# EAGLE design KR55_soundgen (EAGLE 7.1.0)
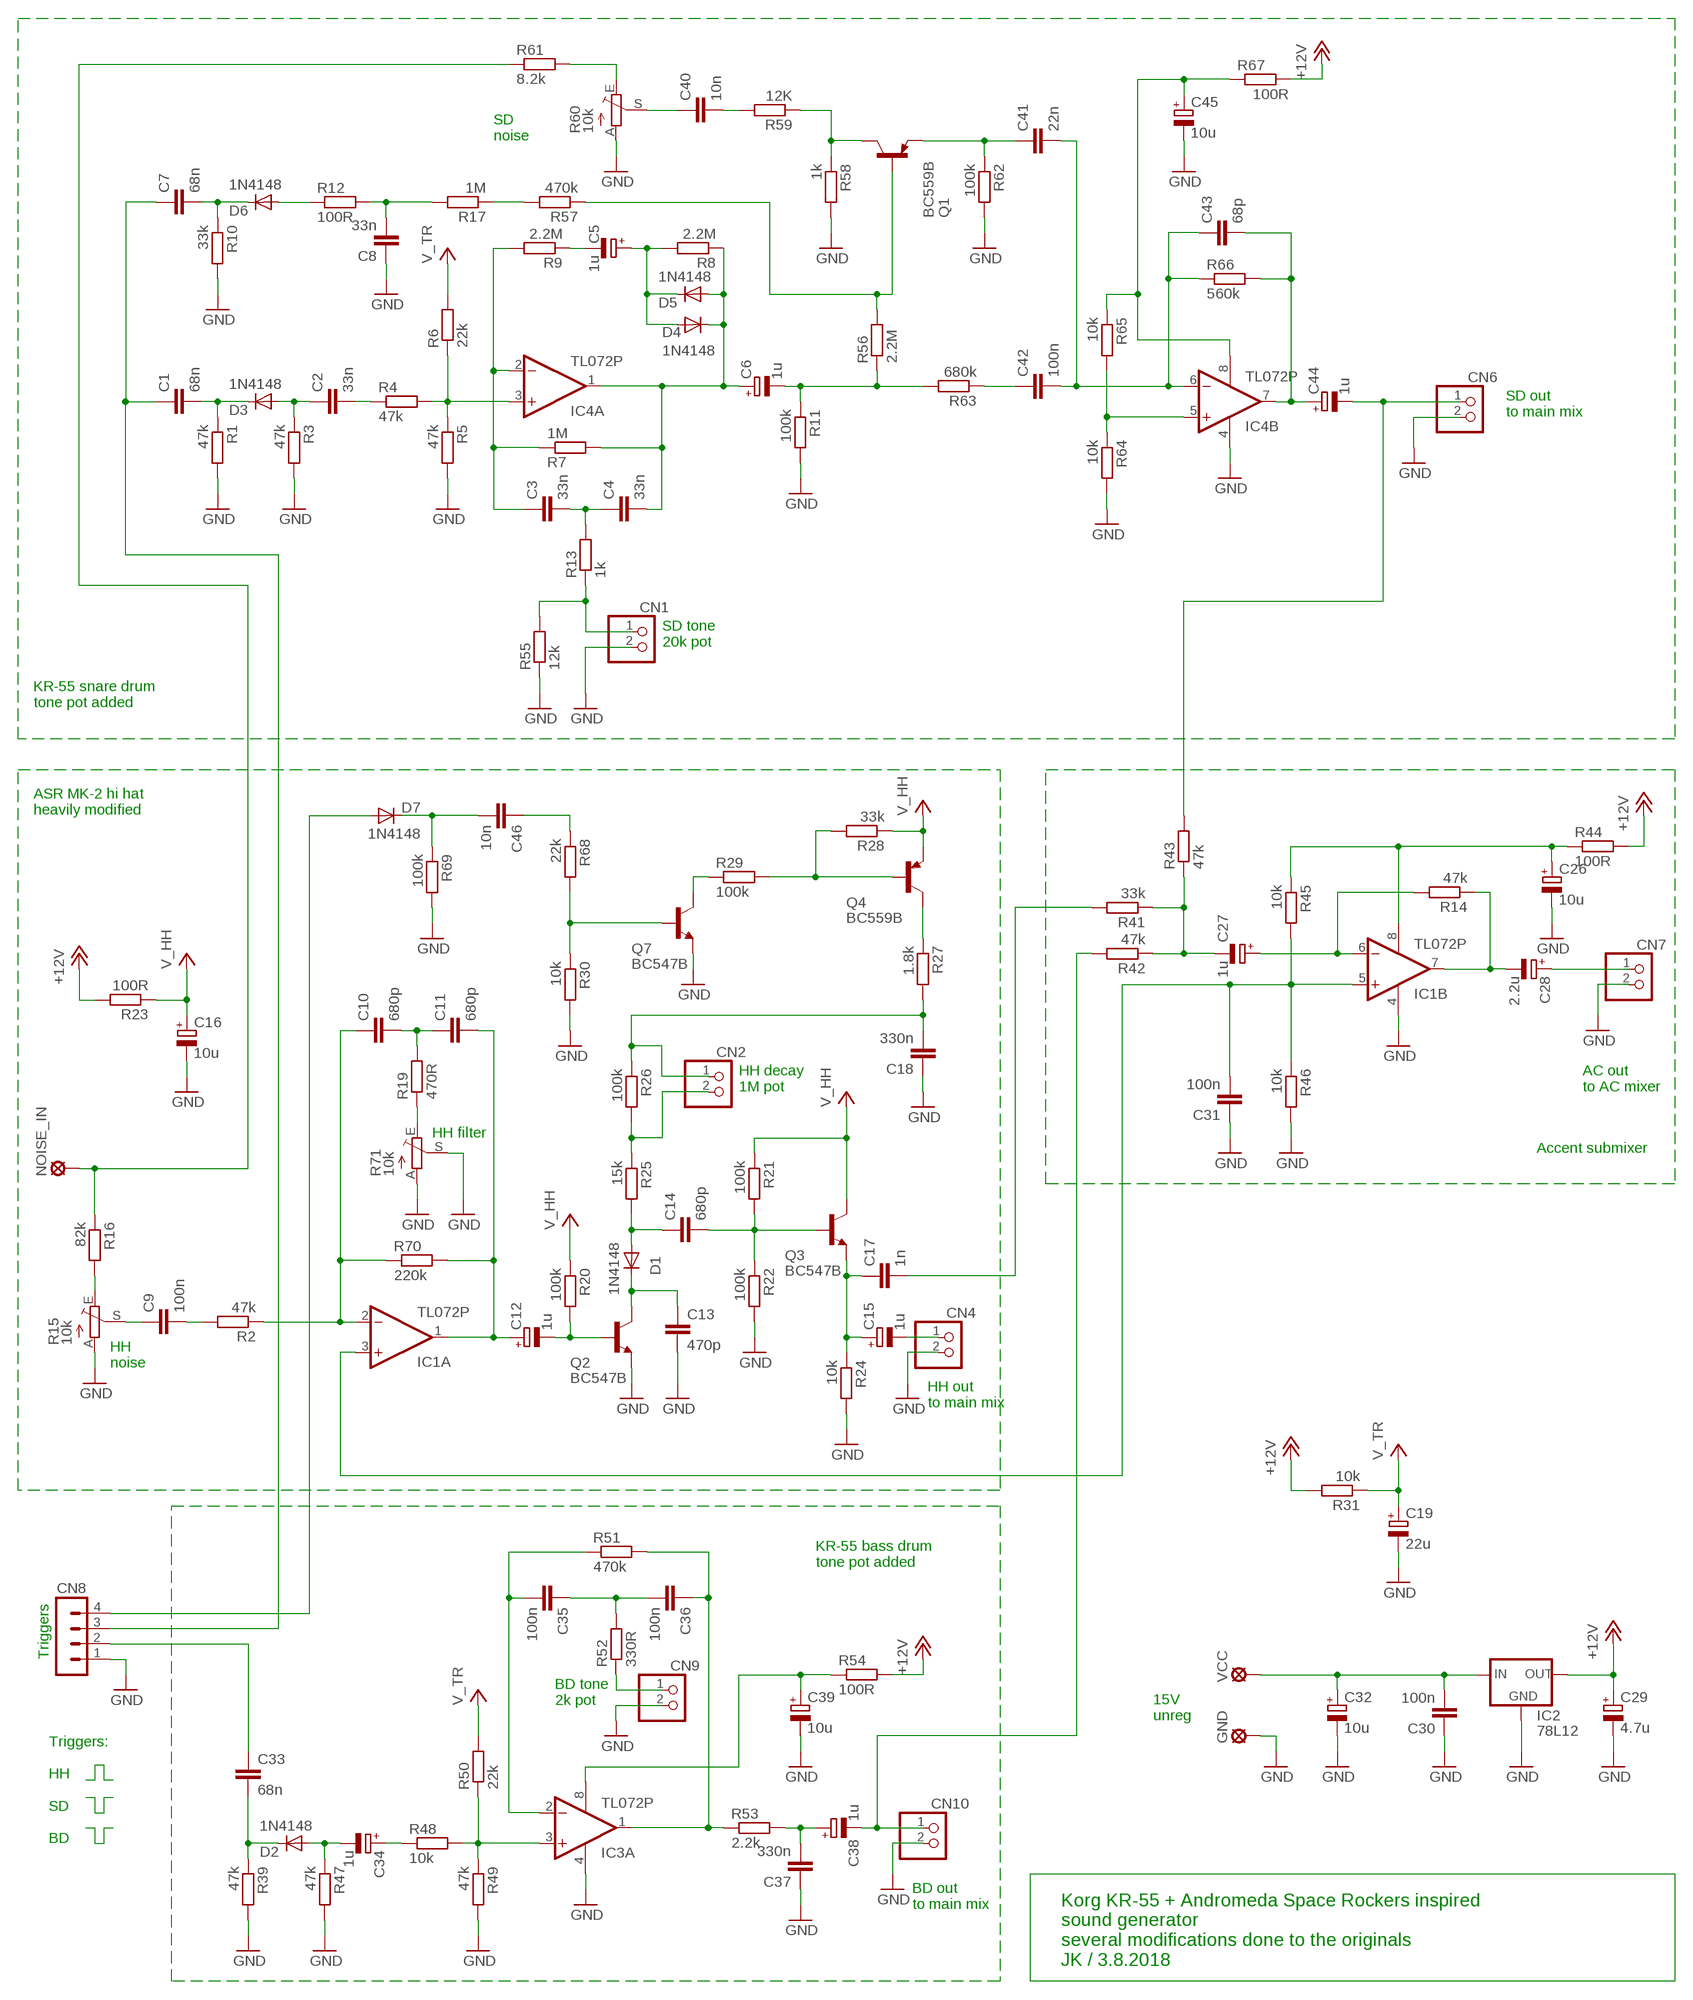
[diagram p0: schematic, sheet 1]

## Parts
C1  68n  C-EUC0805  [C0805]
C2  33n  C-EUC0805  [C0805]
C3  33n  C-EUC0805  [C0805]
C4  33n  C-EUC0805  [C0805]
C5  1u  CPOL-EUSMCA  [SMC_A]
C6  1u  CPOL-EUSMCA  [SMC_A]
C7  68n  C-EUC0805  [C0805]
C8  33n  C-EUC0805  [C0805]
C9  100n  C-EUC0805  [C0805]
C10  680p  C-EUC0805  [C0805]
C11  680p  C-EUC0805  [C0805]
C12  1u  CPOL-EUSMCA  [SMC_A]
C13  470p  C-EUC0805  [C0805]
C14  680p  C-EUC0805  [C0805]
C15  1u  CPOL-EUSMCA  [SMC_A]
C16  10u  CPOL-EUE2.5-5  [E2,5-5]
C17  1n  C-EUC0805  [C0805]
C18  330n  C-EUC0805  [C0805]
C19  22u  CPOL-EUE2.5-5  [E2,5-5]
C26  10u  CPOL-EUE5-5  [E5-5]
C27  1u  CPOL-EUSMCA  [SMC_A]
C28  2.2u  CPOL-EUSMCA  [SMC_A]
C29  4.7u  CPOL-EUSMCA  [SMC_A]
C30  100n  C-EUC0805  [C0805]
C31  100n  C-EUC0805  [C0805]
C32  10u  CPOL-EUE2.5-5  [E2,5-5]
C33  68n  C-EUC0805  [C0805]
C34  1u  CPOL-EUSMCA  [SMC_A]
C35  100n  C-EUC0805  [C0805]
C36  100n  C-EUC0805  [C0805]
C37  330n  C-EUC0805  [C0805]
C38  1u  CPOL-EUSMCA  [SMC_A]
C39  10u  CPOL-EUE2.5-5  [E2,5-5]
C40  10n  C-EUC1206  [C1206]
C41  22n  C-EUC0805  [C0805]
C42  100n  C-EU050-024X044  [C050-024X044]
C43  68p  C-EUC0805  [C0805]
C44  1u  CPOL-EUSMCA  [SMC_A]
C45  10u  CPOL-EUE2.5-5  [E2,5-5]
C46  10n  C-EUC0805  [C0805]
CN1  PINHD-1X2  [1X02]
CN2  PINHD-1X2  [1X02]
CN4  PINHD-1X2  [1X02]
CN6  PINHD-1X2  [1X02]
CN7  PINHD-1X2  [1X02]
CN8  MA04-1  [MA04-1]
CN9  PINHD-1X2  [1X02]
CN10  PINHD-1X2  [1X02]
D1  1N4148  DIODE-SOD80C  [SOD80C]
D2  1N4148  DIODE-SOD80C  [SOD80C]
D3  1N4148  DIODE-SOD80C  [SOD80C]
D4  1N4148  DIODE-SOD80C  [SOD80C]
D5  1N4148  DIODE-SOD80C  [SOD80C]
D6  1N4148  DIODE-SOD80C  [SOD80C]
D7  1N4148  DIODE-DO35-10  [DO35-10]
GND  LSP10  [LSP10]
IC1  TL072P  [DIL08]
IC2  78L12  78LXX  [78LXX]
IC3  TL072P  [DIL08]
IC4  TL072P  [DIL08]
NOISE_IN  LSP10  [LSP10]
Q1  BC559B  [TO92-EBC]
Q2  BC547B  [TO92]
Q3  BC547B  [TO92]
Q4  BC559B  [TO92-EBC]
Q7  BC547B  [TO92]
R1  47k  R-EU_R0805  [R0805]
R2  47k  R-EU_R0805  [R0805]
R3  47k  R-EU_R0805  [R0805]
R4  47k  R-EU_R0805  [R0805]
R5  47k  R-EU_R0805  [R0805]
R6  22k  R-EU_R0805  [R0805]
R7  1M  R-EU_R0805  [R0805]
R8  2.2M  R-EU_R0805  [R0805]
R9  2.2M  R-EU_R0805  [R0805]
R10  33k  R-EU_R0805  [R0805]
R11  100k  R-EU_R0805  [R0805]
R12  100R  R-EU_R0805  [R0805]
R13  1k  R-EU_R0805  [R0805]
R14  47k  R-EU_R0805  [R0805]
R15  10k  TRIM_EU-S63X  [S63X]
R16  82k  R-EU_R0805  [R0805]
R17  1M  R-EU_R0805  [R0805]
R19  470R  R-EU_0207/10  [0207/10]
R20  100k  R-EU_0207/10  [0207/10]
R21  100k  R-EU_R0805  [R0805]
R22  100k  R-EU_R0805  [R0805]
R23  100R  R-EU_R0805  [R0805]
R24  10k  R-EU_R0805  [R0805]
R25  15k  R-EU_0207/10  [0207/10]
R26  100k  R-EU_R0805  [R0805]
R27  1.8k  R-EU_0207/10  [0207/10]
R28  33k  R-EU_R0805  [R0805]
R29  100k  R-EU_R0805  [R0805]
R30  10k  R-EU_R0805  [R0805]
R31  10k  R-EU_R0805  [R0805]
R39  47k  R-EU_R0805  [R0805]
R41  33k  R-EU_R0805  [R0805]
R42  47k  R-EU_R0805  [R0805]
R43  47k  R-EU_R0805  [R0805]
R44  100R  R-EU_0207/10  [0207/10]
R45  10k  R-EU_R0805  [R0805]
R46  10k  R-EU_R0805  [R0805]
R47  47k  R-EU_R0805  [R0805]
R48  10k  R-EU_R0805  [R0805]
R49  47k  R-EU_R0805  [R0805]
R50  22k  R-EU_R0805  [R0805]
R51  470k  R-EU_R0805  [R0805]
R52  330R  R-EU_R0805  [R0805]
R53  2.2k  R-EU_0207/10  [0207/10]
R54  100R  R-EU_0207/10  [0207/10]
R55  12k  R-EU_R0805  [R0805]
R56  2.2M  R-EU_R0805  [R0805]
R57  470k  R-EU_R0805  [R0805]
R58  1k  R-EU_R0805  [R0805]
R59  12K  R-EU_R0805  [R0805]
R60  10k  TRIM_EU-S63X  [S63X]
R61  8.2k  R-EU_R0805  [R0805]
R62  100k  R-EU_R0805  [R0805]
R63  680k  R-EU_R0805  [R0805]
R64  10k  R-EU_R0805  [R0805]
R65  10k  R-EU_R0805  [R0805]
R66  560k  R-EU_R0805  [R0805]
R67  100R  R-EU_R0805  [R0805]
R68  22k  R-EU_R0805  [R0805]
R69  100k  R-EU_R0805  [R0805]
R70  220k  R-EU_R0805  [R0805]
R71  10k  TRIM_EU-S63X  [S63X]
VCC  LSP10  [LSP10]

## Nets
+12V: C29.+ IC2.OUT R23.2 R31.2 R44.2 R54.2 R67.2
+15V: C30.2 C32.+ IC2.IN VCC.MP
GND: C8.1 C13.2 C16.- C18.1 C19.- C26.- C29.- C30.1 C31.1 C32.- C37.1 C39.- C45.- CN1.2 CN4.2 CN6.2 CN7.2 CN8.1 CN9.2 CN10.2 GND.MP IC1.4(P:V-) IC2.GND IC3.4(P:V-) IC4.4(P:V-) Q2.1(E) Q7.1(E) R1.2 R3.2 R5.2 R10.2 R11.2 R15.A R22.2 R24.2 R30.2 R39.2 R46.2 R47.2 R49.2 R55.1 R58.2 R60.A R62.2 R64.2 R69.2 R71.A R71.S
N$2: C3.1 IC4.2(A:-IN) R7.1 R9.2
N$3: C4.2 C6.+ D4.C D5.A IC4.1(A:OUT) R7.2 R8.1
N$4: IC4.3(A:+IN) R4.2 R5.1 R6.1
N$5: C2.2 R4.1
N$6: C2.1 D3.A R3.1
N$7: C1.2 D3.C R1.1
N$8: R15.E R16.2
N$9: CN1.1 R13.1 R55.2
N$10: C9.1 R15.S
N$11: C5.- R9.1
N$12: C5.+ D4.A D5.C R8.2
N$13: R60.E R61.2
N$14: C9.2 R2.2
N$15: R19.1 R71.E
N$17: C12.- Q2.2(B) R20.2
N$18: C11.2 C12.+ IC1.1(A:OUT) R70.2
N$19: C13.1 D1.C Q2.3(C)
N$20: C10.1 IC1.2(A:-IN) R2.1 R70.1
N$21: C10.2 C11.1 R19.2
N$23: C14.1 D1.A R25.2
N$24: C14.2 Q3.2(B) R21.2 R22.1
N$25: C41.2 C42.2 C43.1 IC4.6(B:-IN) R66.1
N$26: C35.2 IC3.2(A:-IN) R51.1
N$27: C15.+ C17.1 Q3.1(E) R24.1
N$28: CN2.2 R25.1 R26.2
N$29: C18.2 CN2.1 R26.1 R27.2
N$30: C8.2 R12.2 R17.2
N$31: Q4.C R27.1
N$32: R17.1 R57.2
N$41: C27.- R41.1 R42.1 R43.1
N$42: C28.- IC1.7(B:OUT) R14.1
N$43: C27.+ IC1.6(B:-IN) R14.2
N$50: C36.1 IC3.1(A:OUT) R51.2 R53.1
N$51: C35.1 C36.2 R52.2
N$52: CN9.1 R52.1
N$53: IC3.3(A:+IN) R48.2 R49.1 R50.1
N$54: C34.+ R48.1
N$55: C34.- D2.A R47.1
N$56: C33.2 D2.C R39.1
N$57: C37.2 C38.+ R53.2
N$59: C3.2 C4.1 R13.2
N$61: C40.1 R60.S
N$62: D6.A R12.1
N$63: C7.2 D6.C R10.1
N$64: C40.2 R59.2
N$65: Q1.C R58.1 R59.1
N$66: Q1.B R56.2 R57.1
N$67: C6.- R11.1 R56.1 R63.2
N$68: C42.1 R63.1
N$69: C41.1 Q1.E R62.1
N$71: IC4.5(B:+IN) R64.1 R65.2
N$72: C43.2 C44.+ IC4.7(B:OUT) R66.2
N$74: C45.+ IC4.8(P:V+) R65.1 R67.1
N$78: Q4.B R28.2 R29.2
N$79: Q7.3(C) R29.1
N$80: Q7.2(B) R30.1 R68.2
N$81: C46.1 R68.1
N$82: C46.2 D7.C R69.1
NOISE_IN: NOISE_IN.MP R16.1 R61.1
OUT_AC: C28.+ CN7.1
OUT_BD: C38.- CN10.1 R42.2
OUT_HH: C15.- CN4.1
OUT_HH_AC: C17.2 R41.2
OUT_SD: C44.- CN6.1 R43.2
TRIG_BD: C33.1 CN8.2
TRIG_HH: CN8.4 D7.A
TRIG_SD: C1.1 C7.1 CN8.3
V_BD: C39.+ IC3.8(P:V+) R54.1
V_HH: C16.+ Q3.3(C) Q4.E R20.1 R21.1 R23.1 R28.1
V_MX: C26.+ IC1.8(P:V+) R44.1 R45.1
V_MX/2: C31.2 IC1.3(A:+IN) IC1.5(B:+IN) R45.2 R46.1
V_TR: C19.+ R6.2 R31.1 R50.2
Unconnected: IC3.5(B:+IN) IC3.6(B:-IN) IC3.7(B:OUT)

## Notes on the sheet
- SD
  noise
- SD out
  to main mix
- SD tone
  20k pot
- KR-55 snare drum
  tone pot added
- ASR MK-2 hi hat
  heavily modified
- HH decay
  1M pot
- AC out
  to AC mixer
- HH filter
- Accent submixer
- HH
  noise
- HH out
  to main mix
- KR-55 bass drum
  tone pot added
- Triggers
- BD tone
  2k pot
- 15V
  unreg
- Triggers:
  
  HH
  
  SD
  
  BD
- BD out
  to main mix
- Korg KR-55 + Andromeda Space Rockers inspired
  sound generator
  several modifications done to the originals
  JK / 3.8.2018

## Library data of the parts
C1-C4 C7-C11 C13 C14 C17 C18 C30 C31 C33 C35-C37 C40-C43 C46 = rcl:C-EU: CAPACITOR, European symbol
C5 C6 C12 C15 C16 C19 C26-C29 C32 C34 C38 C39 C44 C45 = rcl:CPOL-EU: POLARIZED CAPACITOR, European symbol
CN1 CN2 CN4 CN6 CN7 CN9 CN10 = pinhead:PINHD-1X2: PIN HEADER
CN8 = con-lstb:MA04-1: PIN HEADER; OC_FARNELL: unknown; OC_NEWARK: unknown
D1-D7 = diode:DIODE-: DIODE
GND NOISE_IN VCC = solpad:LSP10: SOLDER PAD drill 1.0 mm, distributor Buerklin, 12H555
IC1 IC3 IC4 = linear:TL072: OP AMP
IC2 = v-reg:78LXX: VOLTAGE REGULATOR
Q1 Q4 = transistor-pnp:BC559*: PNP Transistror
Q2 Q3 Q7 = transistor-npn:BC547*: NPN Transistor
R1-R14 R16 R17 R19-R31 R39 R41-R59 R61-R70 = rcl:R-EU_: RESISTOR, European symbol
R15 R60 R71 = pot:TRIM_EU-: POTENTIOMETER

## Board
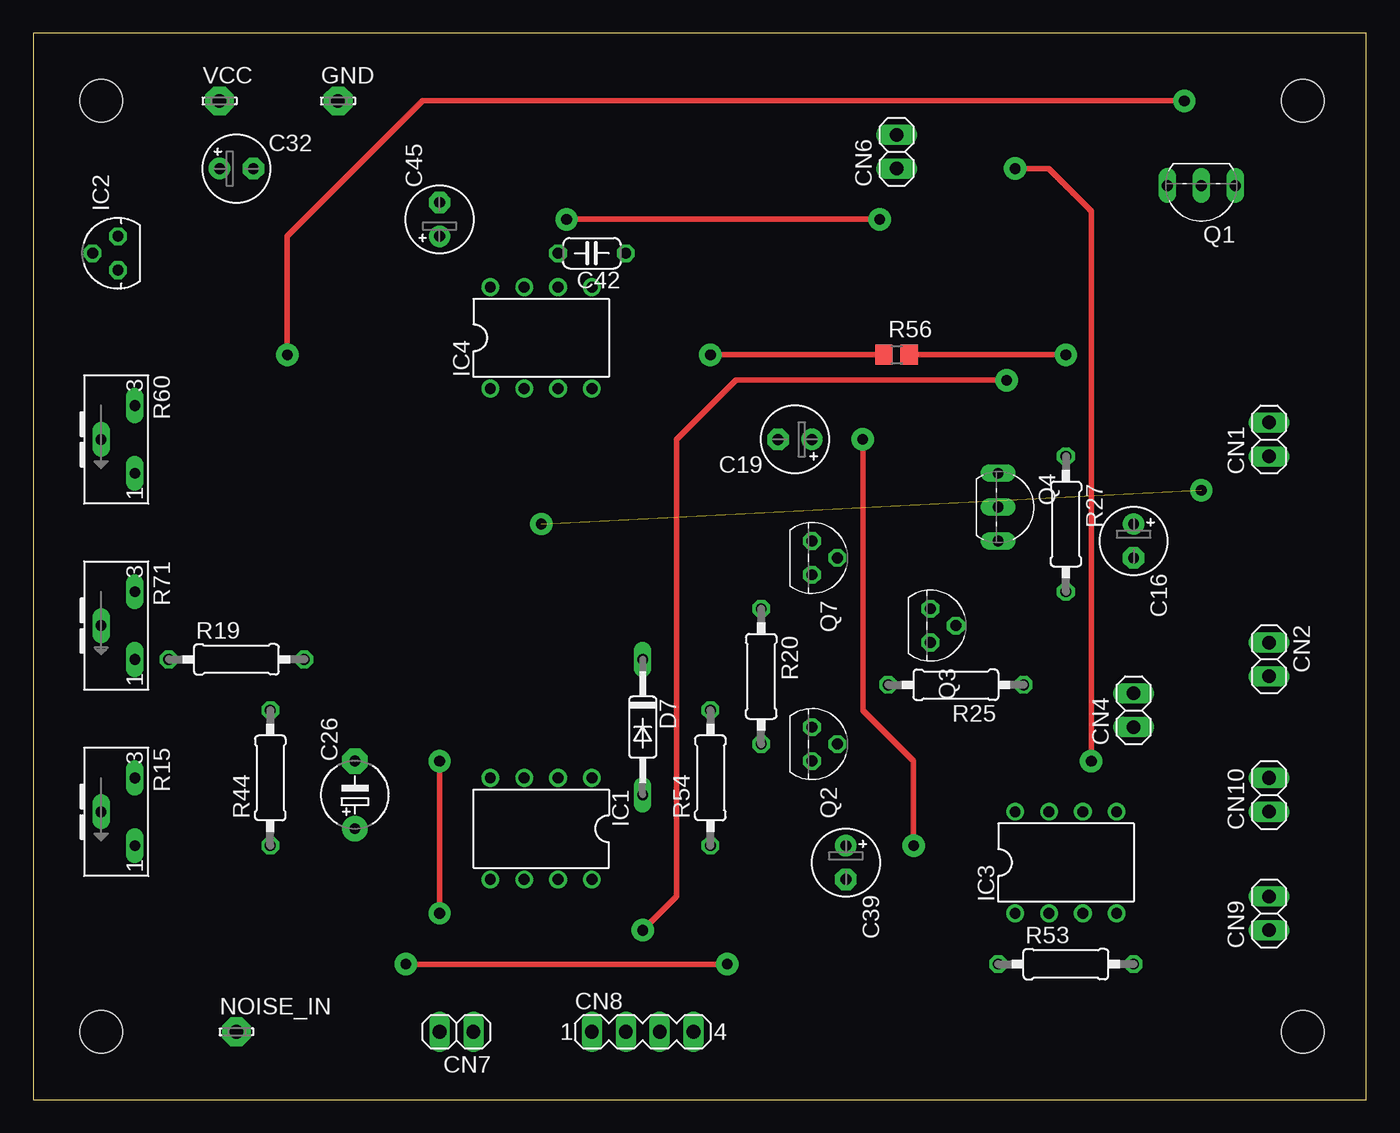
[diagram p1: board, top side]
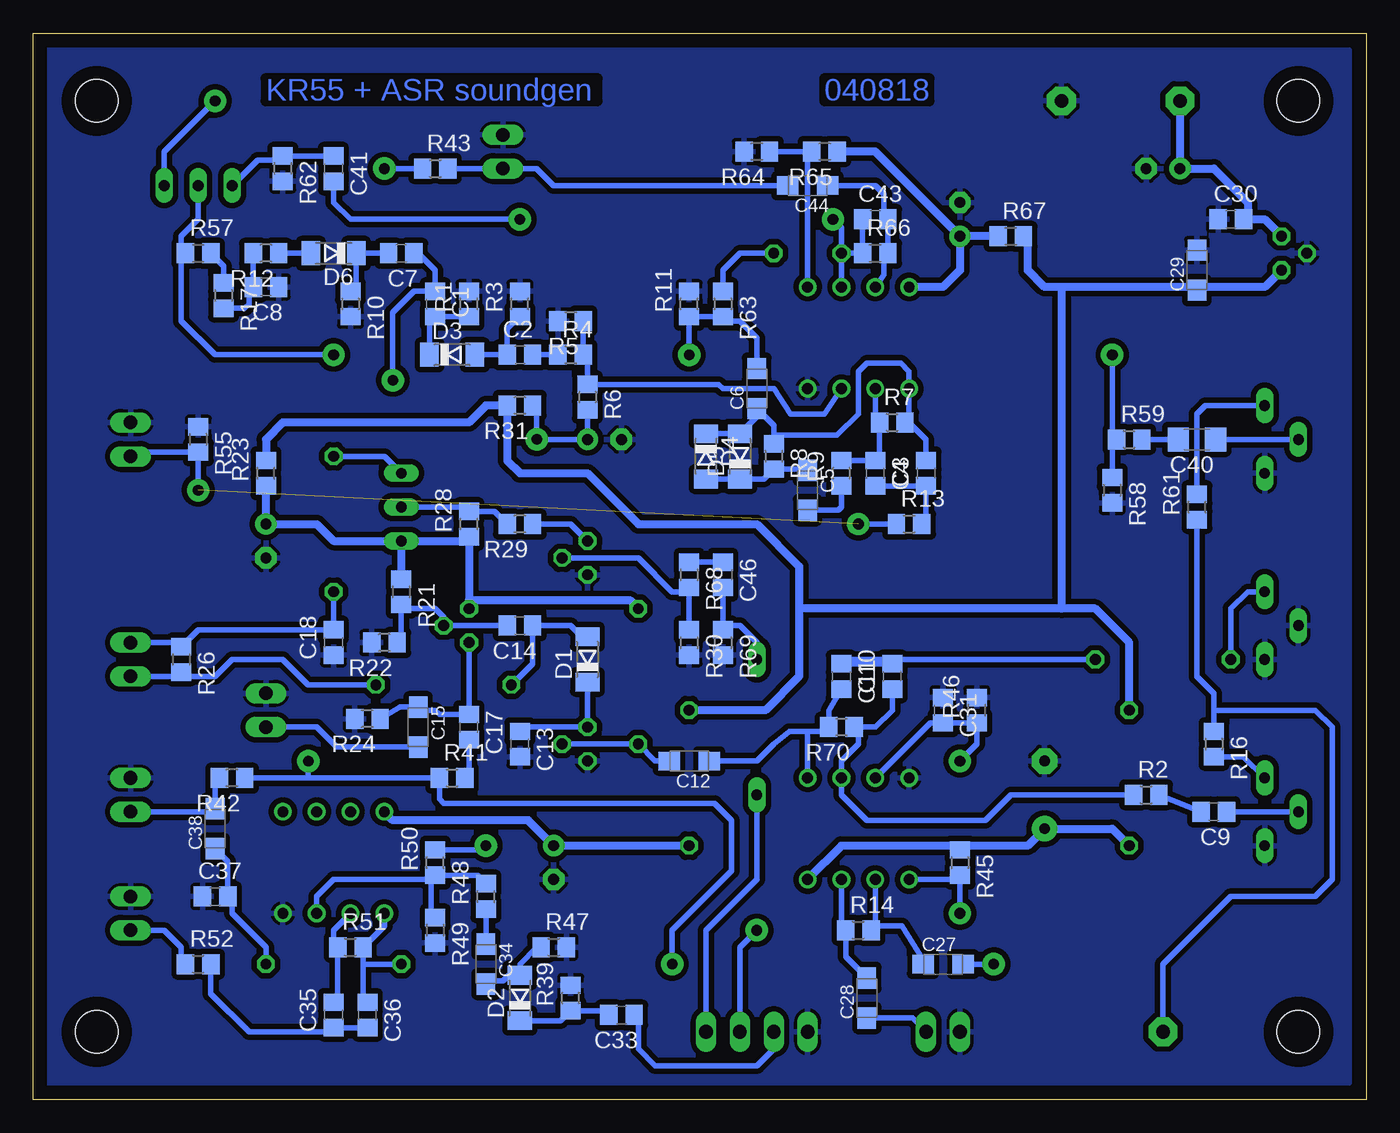
[diagram p2: board, bottom side, seen from below]

Size 100 x 80 mm. Coordinates in mm from the lower left corner, seen from the top.
Outline: 0,0 100,0 100,80 0,80 0,0
Copper layers (1*16): Top 0.035mm / dielectric 1.5mm / Bottom 0.035mm
Design rules "default": minimum track width 10mil, minimum drill 24mil, track to track 8mil, track to pad 8mil, pad to pad 8mil, via to via 8mil, smd to smd 8mil, copper to edge 40mil, drill to drill 8mil, minimum pad ring 10mil, minimum via ring 8mil, stop-mask expansion 4mil, vias tented up to drill 0mil, thermal gap 10mil
Holes 3.2 mm at 5.08,5.08 95.25,5.08 95.25,74.93 5.08,74.93

### Footprints (pad centres in the part's own frame; a part is rotated, then mirrored left to right if it is on the bottom)
C0805 = smd 1.3 x 1.5: 1 -0.95,0; 2 0.95,0
SMC_A = smd 1.6 x 1.4: + -1.5,0; - 1.5,0
E2,5-5 = drill 0.813 pad 1.6: + -1.27,0 | drill 0.813 pad 1.6 octagon: - 1.27,0
E5-5 = drill 0.813 pad 1.905: + -2.54,0 | drill 0.813 pad 1.905 octagon: - 2.54,0
C1206 = smd 1.6 x 1.8: 1 -1.4,0; 2 1.4,0
C050-024X044 = drill 0.813 octagon: 1 -2.54,0; 2 2.54,0
1X02 = drill 1.016 long: 1 -1.27,0; 2 1.27,0
MA04-1 = drill 1.016 long: 1 -3.81,0; 2 -1.27,0; 3 1.27,0; 4 3.81,0
SOD80C = smd 1.4 x 1.8: A 1.7,0; C -1.7,0
DO35-10 = drill 0.813 long: A 5.08,0; C -5.08,0
LSP10 = drill 1.016 pad 2.159 octagon: MP 0,0
DIL08 = drill 0.813 pad 1.27: 1 -3.81,-3.81; 2 -1.27,-3.81; 3 1.27,-3.81; 4 3.81,-3.81; 5 3.81,3.81; 6 1.27,3.81; 7 -1.27,3.81; 8 -3.81,3.81
78LXX = drill 0.813 octagon: GND 0,1.905; IN 1.27,0; OUT -1.27,0
TO92-EBC = drill 0.813 long: B 0,-1.27; C -2.54,-1.27; E 2.54,-1.27
TO92 = drill 0.813 octagon: 1 1.27,0; 2 0,1.905; 3 -1.27,0
R0805 = smd 1.3 x 1.5: 1 -0.95,0; 2 0.95,0
S63X = drill 0.813 long: A 2.54,0; E -2.54,0; S 0,-2.54
0207/10 = drill 0.813 octagon: 1 -5.08,0; 2 5.08,0

### Placement (x,y rotation side)
C1  69.85,59.69 270 bottom
C2  63.5,55.88 0 bottom
C3  36.83,46.99 270 bottom
C4  33.02,46.99 90 bottom
C5  41.91,45.72 270 bottom
C6  45.72,53.34 90 bottom
C7  72.39,63.5 180 bottom
C8  82.55,60.96 180 bottom
C9  11.43,21.59 180 bottom
C10  35.56,31.75 90 bottom
C11  39.37,31.75 270 bottom
C12  50.8,25.4 180 bottom
C13  63.5,26.67 270 bottom
C14  63.5,35.56 180 bottom
C15  71.12,27.94 270 bottom
C16  82.55,41.91 270 top
C17  67.31,27.94 270 bottom
C18  77.47,34.29 90 bottom
C19  57.15,49.53 180 top
C26  24.13,22.86 90 top
C27  31.75,10.16 0 bottom
C28  37.47,7.62 90 bottom
C29  12.7,62.23 90 bottom
C30  10.16,66.04 0 bottom
C31  31.75,29.21 270 bottom
C32  15.24,69.85 0 top
C33  55.88,6.35 180 bottom
C34  66.04,10.16 270 bottom
C35  77.47,6.35 90 bottom
C36  74.93,6.35 270 bottom
C37  86.36,15.24 0 bottom
C38  86.36,20.32 90 bottom
C39  60.96,17.78 270 top
C40  12.7,49.53 180 bottom
C41  77.47,69.85 270 bottom
C42  41.91,63.5 180 top
C43  36.83,66.04 0 bottom
C44  41.91,68.58 180 bottom
C45  30.48,66.04 90 top
C46  48.26,39.37 270 bottom
CN1  92.71,49.53 90 top
CN2  92.71,33.02 270 top
CN4  82.55,29.21 90 top
CN6  64.77,71.12 90 top
CN7  31.75,5.08 180 top
CN8  45.72,5.08 0 top
CN9  92.71,13.97 90 top
CN10  92.71,22.86 90 top
D1  58.42,33.02 90 bottom
D2  63.5,7.62 90 bottom
D3  68.58,55.88 0 bottom
D4  49.53,48.26 270 bottom
D5  46.99,48.26 90 bottom
D6  77.47,63.5 180 bottom
D7  45.72,27.94 270 top
GND  22.86,74.93 0 top
IC1  38.1,20.32 180 top
IC2  6.35,63.5 90 top
IC3  77.47,17.78 0 top
IC4  38.1,57.15 0 top
NOISE_IN  15.24,5.08 0 top
Q1  87.63,67.31 180 top
Q2  58.42,26.67 270 top
Q3  67.31,35.56 270 top
Q4  73.66,44.45 270 top
Q7  58.42,40.64 270 top
R1  67.31,59.69 90 bottom
R2  16.51,22.86 0 bottom
R3  63.5,59.69 90 bottom
R4  59.69,55.88 0 bottom
R5  59.69,58.42 180 bottom
R6  58.42,52.7 270 bottom
R7  35.56,50.8 0 bottom
R8  44.45,48.26 270 bottom
R9  39.37,46.99 90 bottom
R10  76.2,59.69 270 bottom
R11  50.8,59.69 90 bottom
R12  82.55,63.5 180 bottom
R13  34.29,43.18 0 bottom
R14  38.1,12.7 0 bottom
R15  7.62,21.59 270 top
R16  11.43,26.67 270 bottom
R17  85.72,60.33 270 bottom
R19  15.24,33.02 0 top
R20  54.61,31.75 270 top
R21  72.39,38.1 270 bottom
R22  73.66,34.29 180 bottom
R23  82.55,46.99 90 bottom
R24  74.93,28.57 180 bottom
R25  69.22,31.11 180 top
R26  88.9,33.02 270 bottom
R27  77.47,43.18 270 top
R28  67.31,43.18 90 bottom
R29  63.5,43.18 180 bottom
R30  50.8,34.29 270 bottom
R31  63.5,52.07 180 bottom
R39  59.69,7.62 90 bottom
R41  68.58,24.13 0 bottom
R42  85.09,24.13 180 bottom
R43  69.85,69.85 0 bottom
R44  17.78,24.13 90 top
R45  30.48,17.78 270 bottom
R46  29.21,29.21 90 bottom
R47  60.96,11.43 0 bottom
R48  66.04,15.24 90 bottom
R49  69.85,12.7 270 bottom
R50  69.85,17.78 90 bottom
R51  76.2,11.43 0 bottom
R52  87.63,10.16 0 bottom
R53  77.47,10.16 0 top
R54  50.8,24.13 90 top
R55  87.63,49.53 270 bottom
R56  64.77,55.88 0 top
R57  87.63,63.5 0 bottom
R58  19.05,45.72 270 bottom
R59  17.78,49.53 0 bottom
R60  7.62,49.53 270 top
R61  12.7,44.45 90 bottom
R62  81.28,69.85 270 bottom
R63  48.26,59.69 270 bottom
R64  45.72,71.12 180 bottom
R65  40.64,71.12 180 bottom
R66  36.83,63.5 0 bottom
R67  26.67,64.77 0 bottom
R68  50.8,39.37 270 bottom
R69  48.26,34.29 270 bottom
R70  39.37,27.94 180 bottom
R71  7.62,35.56 270 top
VCC  13.97,74.93 0 top

### Tracks (layer width: path | path; a pad name or v marks a point on that pad's centre or on a via)
+12V
  Bottom 0.406: 12.47,60.96 C29.+ 12.93,60.73 12.7,60.96 | 25.4,64.45 R67.2
  Bottom 0.61: IC2.OUT 7.62,60.96 12.47,60.96 | R44.2 17.78,34.29 20.32,36.83 22.86,36.83 | 22.86,36.83 42.55,36.83 | 42.55,36.83 42.55,31.75 45.09,29.21 R54.2 | R23.2 82.55,49.53 81.28,50.8 67.31,50.8 66.04,52.07 R31.2 64.45,47.94 63.5,46.99 58.42,46.99 54.61,43.18 45.72,43.18 42.55,40.01 42.55,36.83 | 12.7,60.96 22.86,60.96 | 22.86,60.96 22.86,36.83 | 22.86,60.96 24.13,60.96 25.4,62.23 25.4,64.45
+15V
  Bottom 0.406: 8.89,66.36 C30.2
  Bottom 0.61: VCC.MP C32.+ 11.43,69.85 8.89,67.31 8.89,66.36 | C30.2 7.62,66.04 IC2.IN
GND
  Bottom 0.406: 77.15,33.02 C18.1
  pour Bottom (isolate 0.406): 1.27,78.74 99.06,78.74 99.06,1.27 1.27,1.27
N$2
  Bottom 0.406: IC4.2 36.83,51.12 R7.1 36.51,48.26 C3.1 R9.2
N$3
  Bottom 0.406: C4.2 33.02,49.53 34.29,50.8 R7.2 34.29,51.12 IC4.1 34.29,54.61 34.92,55.24 37.47,55.24 38.1,54.61 38.1,51.44 39.69,49.84 44.13,49.84 44.45,49.53 | D4.C D5.A 45.72,51.23 C6.+ 44.45,50.57 44.45,49.53 | R8.1 44.45,49.53
N$4
  Bottom 0.406: IC4.3 40.64,51.44 43.18,51.44 44.45,53.34 48.26,53.34 48.58,53.66 R6.1 58.42,55.56 R4.2 R5.1
N$5
  Bottom 0.406: C2.2 R4.1
N$6
  Bottom 0.406: D3.A C2.1 64.45,57.79 R3.1
N$7
  Bottom 0.406: D3.C 70.28,58.31 C1.2 R1.1
N$8
  Bottom 0.406: R16.2 9.21,25.72 R15.E
N$9  (via drill 0.8 pad 1.68)  (1 unrouted)
  Bottom 0.406: CN1.1 93.66,48.58 R55.2 v87.63,45.72 | R13.1 v38.1,43.18
N$10
  Bottom 0.406: C9.1 R15.S
N$11
  Bottom 0.406: C5.- 39.6,44.22 39.37,44.45 R9.1
N$12
  Bottom 0.406: D4.A D5.C 45.2,46.56 R8.2 42,47.31 C5.+
N$13
  Bottom 0.406: R61.2 12.7,51.44 12.06,52.07 R60.E
N$14
  Bottom 0.406: R2.2 C9.2
N$15
  Bottom 0.406: R19.1 10.16,36.83 8.89,38.1 R71.E
N$17
  Bottom 0.406: C12.- 53.34,25.4 R20.2 Q2.2
N$18
  Bottom 0.406: C11.2 40.32,29.21 R70.2 40.64,27.62 41.91,27.62 | 41.91,27.62 43.27,27.62 44.45,26.67 45.72,25.4 C12.+ | IC1.1 41.91,27.62
N$19
  Bottom 0.406: C13.1 63.5,27.94 Q2.3 D1.C
N$20
  Bottom 0.406: R2.1 26.67,22.86 28.57,20.95 37.47,20.95 39.37,22.86 IC1.2 39.37,25.4 38.1,26.67 38.1,27.62 R70.1 36.83,27.94 35.56,29.21 C10.1
N$21
  Bottom 0.406: C11.1 C10.2 39.05,33.02 R19.2
N$23
  Bottom 0.406: D1.A 58.85,34.72 59.69,35.56 C14.1 62.55,32.7 R25.2
N$24
  Bottom 0.406: C14.2 Q3.2 69.22,36.2 69.85,36.83 72.07,36.83 R21.2 72.39,34.61 R22.1
N$25  (via drill 0.8 pad 1.68)
  Top 0.406: v40.01,66.04 v63.5,66.04
  Bottom 0.406: C43.1 R66.1 C42.2 | IC4.6 C42.2 | C42.2 39.37,65.41 v40.01,66.04 | v63.5,66.04 76.2,66.04 77.47,67.31 C41.2
N$26
  Bottom 0.406: IC3.2 77.47,12.7 77.47,11.75 R51.1 77.15,7.62 C35.2
N$27
  Bottom 0.406: Q3.1 C17.1 69.53,28.89 69.85,29.21 70.89,29.21 C15.+ 72.48,29.44 R24.1
N$28
  Bottom 0.406: CN2.2 89.22,31.75 R26.2 88.58,31.75 86.36,31.75 85.09,33.02 81.28,33.02 79.38,31.11 R25.1
N$29
  Bottom 0.406: CN2.1 88.9,34.29 R26.1 87.63,35.24 C18.2 R27.2
N$30
  Bottom 0.406: R17.2 84.14,59.38 83.82,59.69 83.82,60.64 C8.2 R12.2
N$31
  Bottom 0.406: Q4.C 73.66,48.26 R27.1
N$32
  Bottom 0.406: R17.1 85.72,62.55 R57.2
N$41  (via drill 0.8 pad 1.68)
  Top 0.406: v52.07,10.16 v27.94,10.16 | v79.38,25.4 79.38,66.67 76.2,69.85 v73.66,69.85
  Bottom 0.406: 79.38,24.13 R41.1 69.53,22.54 69.22,22.23 48.9,22.23 47.62,20.95 47.62,17.14 52.07,12.7 v52.07,10.16 | 79.38,24.13 R42.1 | v27.94,10.16 C27.- | 79.38,24.13 v79.38,25.4 | R43.1 v73.66,69.85
N$42
  Bottom 0.406: IC1.7 39.37,13.02 R14.1 39.05,10.71 C28.-
N$43
  Bottom 0.406: IC1.6 36.83,13.02 | 36.83,13.02 R14.2 | 36.83,13.02 34.84,13.02 33.02,10.16 C27.+
N$50
  Bottom 0.406: IC3.1 73.66,13.02 R51.2 75.25,10.16 | 75.25,10.16 75.25,7.62 C36.1 | R53.1 75.25,10.16
N$51
  Bottom 0.406: R52.2 86.68,7.94 83.82,5.08 77.79,5.08 C35.1 C36.2
N$52
  Bottom 0.406: CN9.1 90.17,12.7 88.9,11.43 88.9,10.48 R52.1
N$53
  Bottom 0.406: IC3.3 78.74,15.24 77.47,16.51 70.17,16.51 | 70.17,16.51 R50.1 66.68,16.83 R48.2 | 70.17,16.51 70.17,13.97 R49.1
N$54
  Bottom 0.406: R48.1 C34.+
N$55
  Bottom 0.406: R47.1 62.23,11.43 63.5,10.16 D2.A 64.34,9.32 64.77,8.89 65.81,8.89 C34.-
N$56
  Bottom 0.406: D2.C 60.44,5.92 R39.1 57.15,6.67 C33.2
N$57
  Bottom 0.406: R53.2 82.55,11.43 85.09,13.97 85.09,14.92 C37.2 85.41,17.87 C38.+
N$59
  Bottom 0.406: C3.2 C4.1 33.02,43.5 R13.2
N$61
  Bottom 0.406: R60.S C40.1
N$62
  Bottom 0.406: D6.A R12.1
N$63
  Bottom 0.406: C7.2 D6.C 75.77,61.07 R10.1
N$64
  Bottom 0.406: C40.2 R59.2
N$65  (via drill 0.8 pad 1.68)
  Top 0.406: v19.05,55.88 19.05,64.77 29.21,74.93 v86.36,74.93
  Bottom 0.406: R58.1 19.05,49.21 | 19.05,49.21 R59.1 | 19.05,49.21 v19.05,55.88 | v86.36,74.93 90.17,71.12 Q1.C
N$66  (via drill 0.8 pad 1.68)
  Top 0.406: R56.2 v77.47,55.88
  Bottom 0.406: Q1.B 87.63,66.04 88.9,64.77 88.9,63.82 R57.1 88.9,63.18 88.9,58.42 86.36,55.88 v77.47,55.88
N$67  (via drill 0.8 pad 1.68)
  Top 0.406: v50.8,55.88 R56.1
  Bottom 0.406: C6.- 45.72,57.15 46.99,58.42 47.94,58.42 R63.2 R11.1 v50.8,55.88
N$68
  Bottom 0.406: C42.1 46.99,63.5 48.26,62.23 R63.1
N$69
  Bottom 0.406: Q1.E 83.19,70.48 81.59,70.48 R62.1 C41.1
N$71
  Bottom 0.406: IC4.5 41.91,70.8 R65.2 R64.1
N$72
  Bottom 0.406: IC4.7 36.2,61.91 36.2,63.19 R66.2 C43.2 36.2,66.36 36.2,67.94 36.83,68.58 C44.+
N$74
  Bottom 0.61: R67.1 C45.+ | C45.+ 30.48,62.23 31.75,60.96 IC4.8 | C45.+ 36.83,71.12 R65.1
N$78
  Bottom 0.406: Q4.B 67.63,44.45 R28.2 65.4,44.13 R29.2
N$79
  Bottom 0.406: R29.1 59.69,43.18 Q7.3
N$80
  Bottom 0.406: Q7.2 54.61,40.64 52.07,38.1 51.12,38.1 R68.2 R30.1
N$81
  Bottom 0.406: C46.1 R68.1
N$82
  Bottom 0.406: C46.2 R69.1 47.94,35.56 46.99,35.56 45.72,34.29 D7.C
NOISE_IN
  Bottom 0.406: NOISE_IN.MP 15.24,10.16 10.16,15.24 3.81,15.24 2.54,16.51 2.54,27.94 3.81,29.21 11.43,29.21 R16.1 11.43,30.48 12.7,31.75 R61.1
OUT_AC
  Bottom 0.406: C28.+ 34.06,6.12 CN7.1
OUT_BD
  Bottom 0.406: CN10.1 86.59,21.59 C38.- 86.36,23.81 R42.2
OUT_HH
  Bottom 0.406: C15.- 77.24,26.44 78.74,27.94 CN4.1
OUT_HH_AC
  Bottom 0.406: C17.2 67.31,24.45 R41.2
OUT_SD
  Bottom 0.406: R43.2 CN6.1 62.23,69.85 60.96,68.58 C44.-
TRIG_BD
  Bottom 0.406: CN8.2 44.45,3.81 45.72,2.54 53.34,2.54 54.61,3.81 54.61,6.03 C33.1
TRIG_HH
  Bottom 0.406: CN8.4 49.53,12.7 45.72,16.51 D7.A
TRIG_SD  (via drill 0.8 pad 1.68)
  Top 0.406: v45.72,12.7 48.26,15.24 48.26,49.53 52.7,53.98 v73.03,53.98
  Bottom 0.406: C7.1 71.12,63.5 69.85,62.23 C1.1 71.44,60.64 73.03,59.05 v73.03,53.98 | CN8.3 46.99,11.43 v45.72,12.7
V_BD
  Bottom 0.61: IC3.8 73.03,20.95 62.87,20.95 C39.+ R54.1
V_HH
  Bottom 0.406: 67.63,41.91 R28.1 | Q3.3 67.31,37.47
  Bottom 0.61: Q4.E 77.47,41.91 78.74,43.18 C16.+ R23.1 | Q4.E 67.63,41.91 | Q4.E R21.1 | R28.1 67.31,37.47 55.24,37.47 R20.1
V_MX
  Bottom 0.406: R45.1 30.48,19.05
  Bottom 0.61: IC1.8 39.37,19.05 30.48,19.05 25.4,19.05 C26.+ 19.05,20.32 R44.1
V_MX/2  (via drill 0.8 pad 1.68)
  Top 0.406: v30.48,13.97 v30.48,25.4
  Bottom 0.406: IC1.5 30.8,16.51 R45.2 v30.48,13.97 | v30.48,25.4 29.21,26.67 R46.1 C31.2 32.7,28.26 IC1.3
V_TR  (via drill 0.8 pad 1.68)
  Top 0.406: v66.04,19.05 66.04,25.4 62.23,29.21 v62.23,49.53
  Bottom 0.406: R50.2 66.36,18.73 v66.04,19.05 | v62.23,49.53 62.23,49.21 | v62.23,49.53 62.23,52.07 R31.1 | R6.2 C19.+ v62.23,49.53

### Text on the board
Bottom: 040818 | KR55 + ASR soundgen